# EAGLE board candy-avb (EAGLE 9.2.2), part 1 of 2
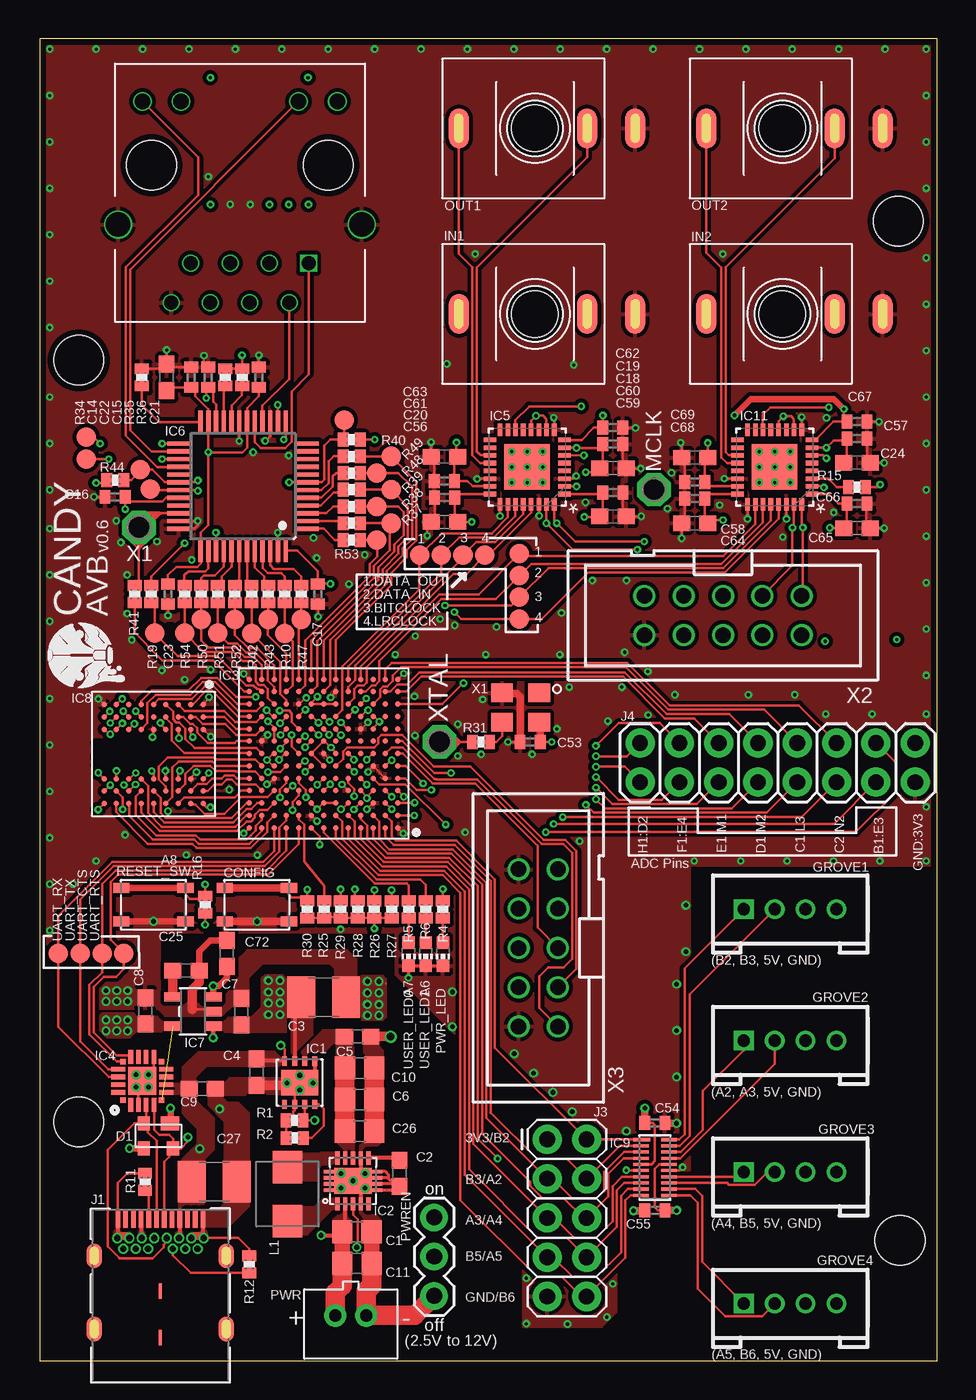
[diagram p5: board, top side]
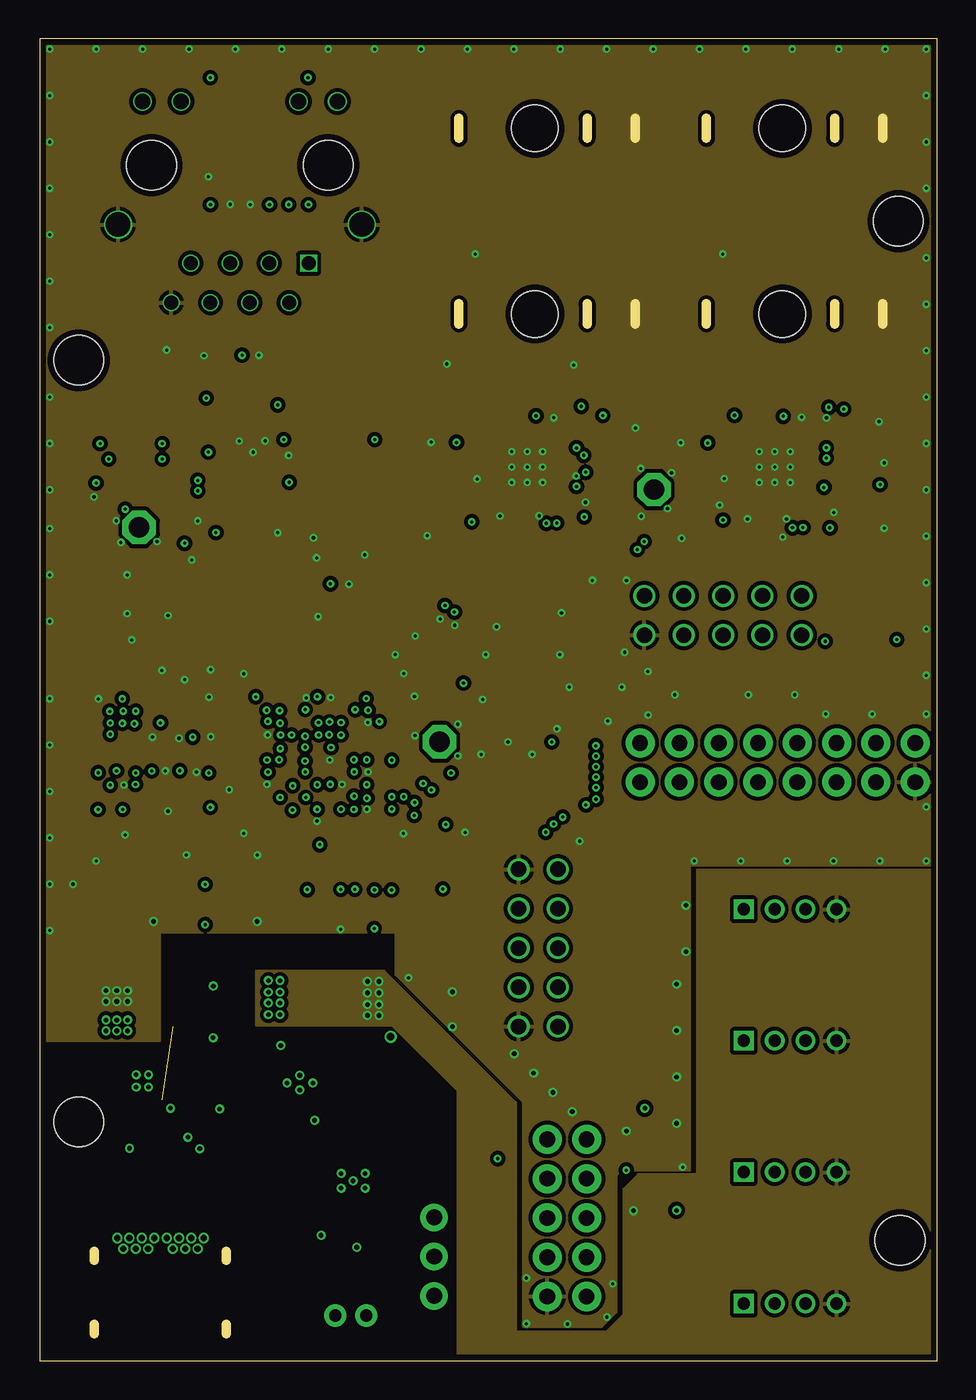
[diagram p6: board, inner layer Route2]
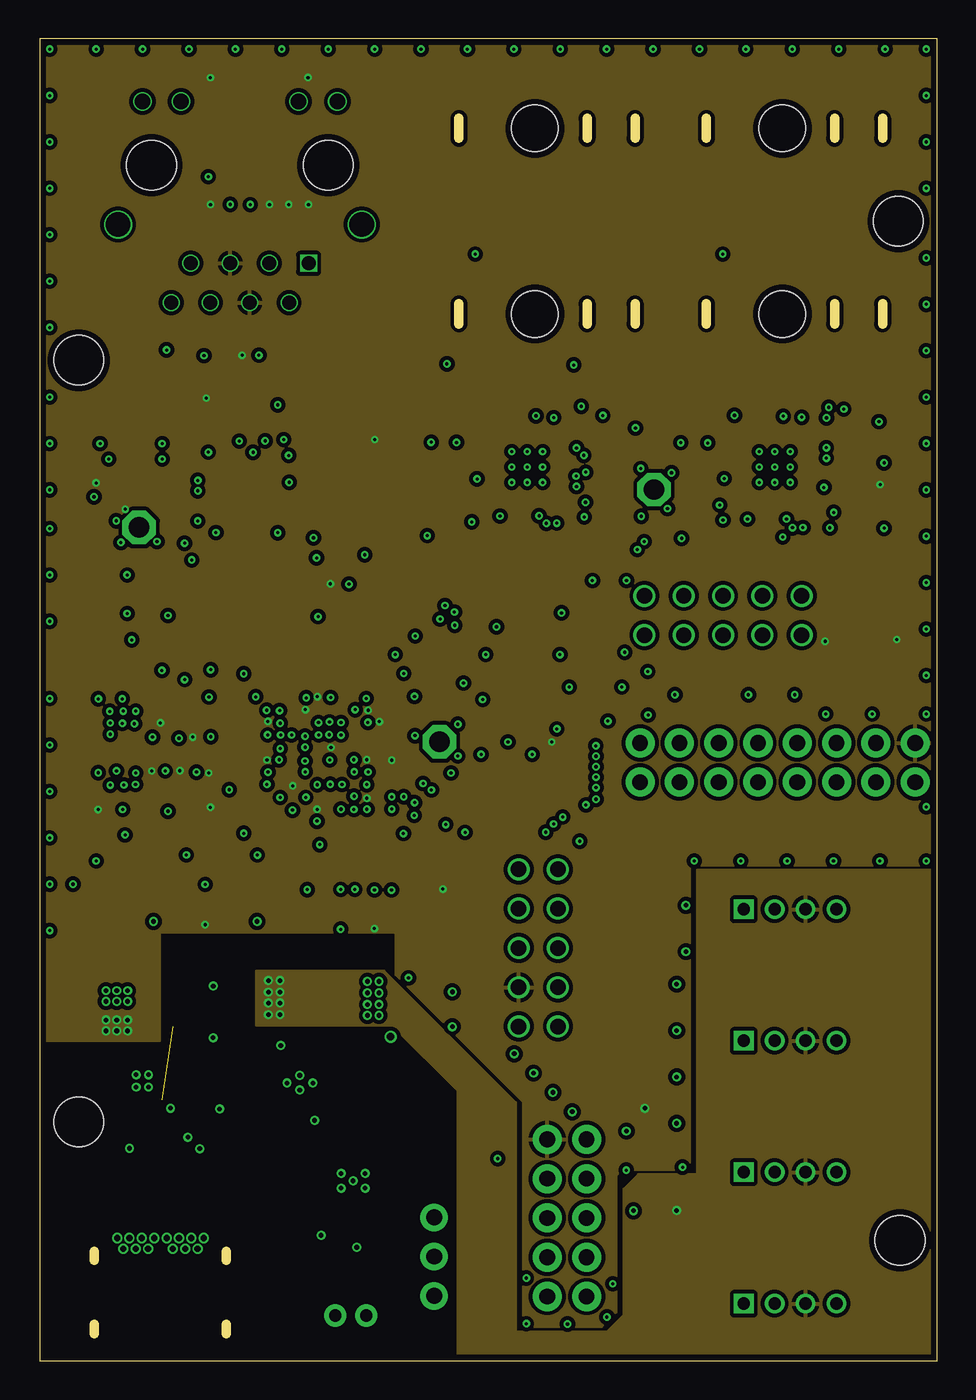
[diagram p7: board, inner layer Route3]
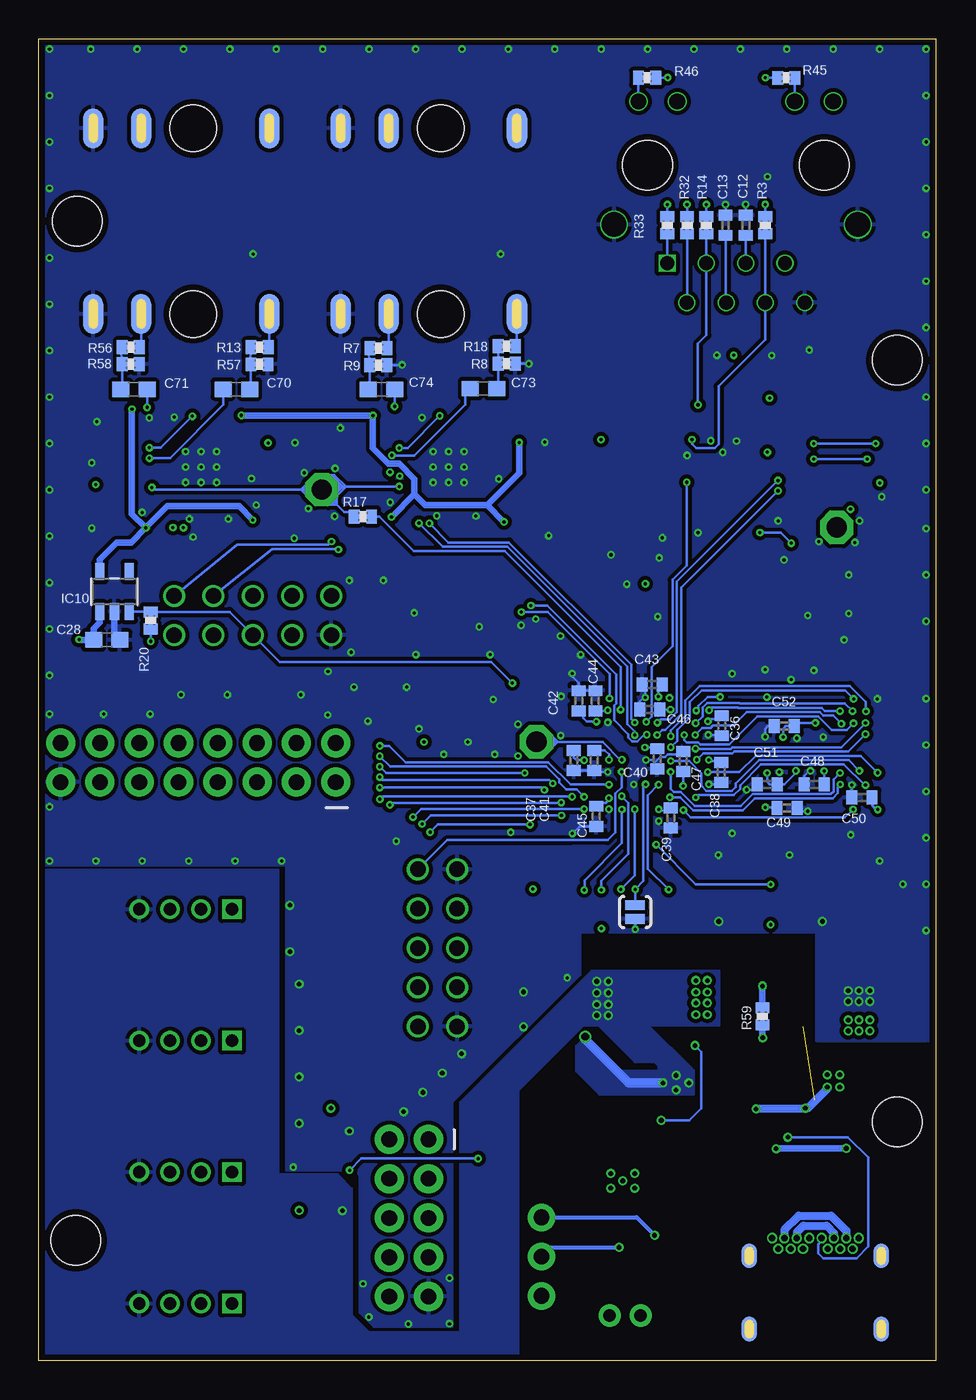
[diagram p8: board, bottom side, seen from below]

Size 58 x 85.5 mm. Coordinates in mm from the lower left corner, seen from the top.
Outline: 58,0 58,85.5 0,85.5 0,0 58,0
Copper layers (1+2*3+16): Top 0.035mm / dielectric 0.25mm / Route2 0.035mm / dielectric 1mm / Route3 0.035mm / dielectric 0.2mm / Bottom 0.035mm
Design rules "pban_5mil-l4-BGA *": minimum track width 0.1mm, minimum drill 0.2mm, track to track 0.125mm, track to pad 0.1mm, pad to pad 0.125mm, via to via 0.2mm, smd to smd 0.1mm, copper to edge 0.4mm, drill to drill 0.4mm, minimum pad ring 0.1mm, minimum via ring 0.1375mm, stop-mask expansion 4mil, vias tented up to drill 0.35mm, thermal gap 10mil
Holes 3.2 mm at 55.5,73.7 55.6,7.8 2.5,64.7 2.5,15.45
tRestrict: area 8.6,54 to 9.3,54.1; area 9,46 to 9.8,46.1; area 8.3,46.4 to 8.5,47.5; area 38.2,38.4 to 54.5,39; area 52.6,39.2 to 52.9,40.5; area 55.7,38.4 to 57.6,38.9; area 55.1,39.3 to 55.5,40.5; area 3.5,39.2 to 8.4,40; area 3.5,38.5 to 7.5,39; area 5,40.1 to 7,40.6; area 7.7,40.2 to 8.2,40.5

## Footprints (pad centres in the part's own frame; a part is rotated, then mirrored left to right if it is on the bottom)
B1,27 = smd 1.27 x 1.27: TP 0,0
C0805 = smd 1.3 x 1.5: 1 -0.95,0; 2 0.95,0
C1608 = smd 1.1 x 1: 1 -0.85,0; 2 0.85,0
C1210 = smd 1.8 x 2.7: 1 -1.45,0; 2 1.45,0
C0402 = smd 0.7 x 0.9: 1 -0.65,0; 2 0.65,0
C0603 = smd 1.1 x 1: 1 -0.85,0; 2 0.85,0
SKRPABE010 = smd 1.05 x 0.65: 1 -2.075,1.075; 2 2.075,1.075; 3 -2.075,-1.075; 4 2.075,-1.075
SOT143 = smd 0.9 x 1.2: 1 -0.8,0.75 | smd 0.9 x 0.8: 2 -0.8,-0.95; 3 0.8,-0.95; 4 0.8,0.95
SEEED_GROVE_4PIN_TH = drill 0.8 pad 1.27 square: 1 -3,0 | drill 0.8 pad 1.27: 2 -1,0; 3 1,0; 4 3,0
SON8 = smd 0.6 x 0.3: 1 -1.4,0.975; 2 -1.4,0.325; 3 -1.4,-0.325; 4 -1.4,-0.975; 5 1.4,-0.975; 6 1.4,-0.325; 7 1.4,0.325; 8 1.4,0.975 | smd 1.65 x 2.4: EP 0,0
S-PDSO-N10 = smd 0.28 x 0.85: 1 -1,-1.475; 2 -0.5,-1.475; 3 0,-1.475; 4 0.5,-1.475; 5 1,-1.475; 6 1,1.475; 7 0.5,1.475; 8 0,1.475; 9 -0.5,1.475; 10 -1,1.475 | smd 2.4 x 1.65: EP0 0,0 | smd 0.7 x 0.25: EP1 -1.55,0.6; EP2 -1.55,0.2; EP3 -1.55,-0.2; EP4 -1.55,-0.6; EP5 1.55,-0.6; EP6 1.55,-0.2; EP7 1.55,0.2; EP8 1.55,0.6
MBGA169-MAX10 = smd 0.34 x 0.34: A1 -4.8,4.8; A2 -4,4.8; A3 -3.2,4.8; A4 -2.4,4.8; A5 -1.6,4.8; A6 -0.8,4.8; A7 0,4.8; A8 0.8,4.8; A9 1.6,4.8; A10 2.4,4.8; A11 3.2,4.8; A12 4,4.8; A13 4.8,4.8; B1 -4.8,4; B2 -4,4; B3 -3.2,4; B4 -2.4,4; B5 -1.6,4; B6 -0.8,4; B7 0,4; B8 0.8,4; B9 1.6,4; B10 2.4,4; B11 3.2,4; B12 4,4; B13 4.8,4; C1 -4.8,3.2; C2 -4,3.2; C3 -3.2,3.2; C4 -2.4,3.2; C5 -1.6,3.2; C6 -0.8,3.2; C7 0,3.2; C8 0.8,3.2; C9 1.6,3.2; C10 2.4,3.2; C11 3.2,3.2; C12 4,3.2; C13 4.8,3.2; D1 -4.8,2.4; D2 -4,2.4; D3 -3.2,2.4; D4 -2.4,2.4; D5 -1.6,2.4; D6 -0.8,2.4; D7 0,2.4; D8 0.8,2.4; D9 1.6,2.4; D10 2.4,2.4; D11 3.2,2.4; D12 4,2.4; D13 4.8,2.4; E1 -4.8,1.6; E2 -4,1.6; E3 -3.2,1.6; E4 -2.4,1.6; E5 -1.6,1.6; E6 -0.8,1.6; E7 0,1.6; E8 0.8,1.6; E9 1.6,1.6; E10 2.4,1.6; E11 3.2,1.6; E12 4,1.6; E13 4.8,1.6; F1 -4.8,0.8; F2 -4,0.8; F3 -3.2,0.8; F4 -2.4,0.8; F5 -1.6,0.8; F6 -0.8,0.8; F7 0,0.8; F8 0.8,0.8; F9 1.6,0.8; F10 2.4,0.8; F11 3.2,0.8; F12 4,0.8; F13 4.8,0.8; G1 -4.8,0; G2 -4,0; G3 -3.2,0; G4 -2.4,0; G5 -1.6,0; G6 -0.8,0; G7 0,0; G8 0.8,0; G9 1.6,0; G10 2.4,0; G11 3.2,0; G12 4,0; G13 4.8,0; H1 -4.8,-0.8; H2 -4,-0.8; H3 -3.2,-0.8; H4 -2.4,-0.8; H5 -1.6,-0.8; H6 -0.8,-0.8; H7 0,-0.8; H8 0.8,-0.8; H9 1.6,-0.8; H10 2.4,-0.8; H11 3.2,-0.8; H12 4,-0.8; H13 4.8,-0.8; J1 -4.8,-1.6; J2 -4,-1.6; J3 -3.2,-1.6; J4 -2.4,-1.6; J5 -1.6,-1.6; J6 -0.8,-1.6; J7 0,-1.6; J8 0.8,-1.6; J9 1.6,-1.6; J10 2.4,-1.6; J11 3.2,-1.6; J12 4,-1.6; J13 4.8,-1.6; K1 -4.8,-2.4; K2 -4,-2.4; K3 -3.2,-2.4; K4 -2.4,-2.4; K5 -1.6,-2.4; K6 -0.8,-2.4; K7 0,-2.4; K8 0.8,-2.4; K9 1.6,-2.4; K10 2.4,-2.4; K11 3.2,-2.4; K12 4,-2.4; K13 4.8,-2.4; L1 -4.8,-3.2; L2 -4,-3.2; L3 -3.2,-3.2; L4 -2.4,-3.2; L5 -1.6,-3.2; L6 -0.8,-3.2; L7 0,-3.2; L8 0.8,-3.2; L9 1.6,-3.2; L10 2.4,-3.2; L11 3.2,-3.2; L12 4,-3.2; L13 4.8,-3.2; M1 -4.8,-4; M2 -4,-4; M3 -3.2,-4; M4 -2.4,-4; M5 -1.6,-4; M6 -0.8,-4; M7 0,-4; M8 0.8,-4; M9 1.6,-4; M10 2.4,-4; M11 3.2,-4; M12 4,-4; M13 4.8,-4; N1 -4.8,-4.8; N2 -4,-4.8; N3 -3.2,-4.8; N4 -2.4,-4.8; N5 -1.6,-4.8; N6 -0.8,-4.8; N7 0,-4.8; N8 0.8,-4.8; N9 1.6,-4.8; N10 2.4,-4.8; N11 3.2,-4.8; N12 4,-4.8; N13 4.8,-4.8
CP2102-QFN20 = smd 0.35 x 0.35: 1 -1.25,1.25; 6 -1.25,-1.25; 11 1.25,-1.25; 16 1.25,1.25 | smd 0.9 x 0.3: 2 -1.55,0.75; 3 -1.55,0.25; 4 -1.55,-0.25; 5 -1.55,-0.75; 12 1.55,-0.75; 13 1.55,-0.25; 14 1.55,0.25; 15 1.55,0.75 | smd 0.3 x 0.9: 7 -0.75,-1.55; 8 -0.25,-1.55; 9 0.25,-1.55; 10 0.75,-1.55; 17 0.75,1.55; 18 0.25,1.55; 19 -0.25,1.55; 20 -0.75,1.55 | smd 1.8 x 1.8: GND 0,0
QFN50_500X500_33_O = smd 0.813 x 0.305: 1 -2.413,1.753; 2 -2.413,1.245; 3 -2.413,0.762; 4 -2.413,0.254; 5 -2.413,-0.254; 6 -2.413,-0.762; 7 -2.413,-1.245; 8 -2.413,-1.753; 17 2.413,-1.753; 18 2.413,-1.245; 19 2.413,-0.762; 20 2.413,-0.254; 21 2.413,0.254; 22 2.413,0.762; 23 2.413,1.245; 24 2.413,1.753 | smd 0.305 x 0.813: 9 -1.753,-2.413; 10 -1.245,-2.413; 11 -0.762,-2.413; 12 -0.254,-2.413; 13 0.254,-2.413; 14 0.762,-2.413; 15 1.245,-2.413; 16 1.753,-2.413; 25 1.753,2.413; 26 1.245,2.413; 27 0.762,2.413; 28 0.254,2.413; 29 -0.254,2.413; 30 -0.762,2.413; 31 -1.245,2.413; 32 -1.753,2.413 | smd 2.946 x 2.946: 33 0,0
LQFP48 = smd 1.5 x 0.279: 1 -4.15,2.75; 2 -4.15,2.25; 3 -4.15,1.75; 4 -4.15,1.25; 5 -4.15,0.75; 6 -4.15,0.25; 7 -4.15,-0.25; 8 -4.15,-0.75; 9 -4.15,-1.25; 10 -4.15,-1.75; 11 -4.15,-2.25; 12 -4.15,-2.75; 25 4.15,-2.75; 26 4.15,-2.25; 27 4.15,-1.75; 28 4.15,-1.25; 29 4.15,-0.75; 30 4.15,-0.25; 31 4.15,0.25; 32 4.15,0.75; 33 4.15,1.25; 34 4.15,1.75; 35 4.15,2.25; 36 4.15,2.75 | smd 0.279 x 1.5: 13 -2.75,-4.15; 14 -2.25,-4.15; 15 -1.75,-4.15; 16 -1.25,-4.15; 17 -0.75,-4.15; 18 -0.25,-4.15; 19 0.25,-4.15; 20 0.75,-4.15; 21 1.25,-4.15; 22 1.75,-4.15; 23 2.25,-4.15; 24 2.75,-4.15; 37 2.75,4.15; 38 2.25,4.15; 39 1.75,4.15; 40 1.25,4.15; 41 0.75,4.15; 42 0.25,4.15; 43 -0.25,4.15; 44 -0.75,4.15; 45 -1.25,4.15; 46 -1.75,4.15; 47 -2.25,4.15; 48 -2.75,4.15
SOT23-5 = smd 1.1 x 0.6: 1 -1.3,0.95; 2 -1.3,0; 3 -1.3,-0.95; 4 1.3,-0.95; 5 1.3,0.95
FBGA54-AS4C4M16SA = smd 0.34 x 0.34: A1 -3.2,3.2; A2 -2.4,3.2; A3 -1.6,3.2; A7 1.6,3.2; A8 2.4,3.2; A9 3.2,3.2; B1 -3.2,2.4; B2 -2.4,2.4; B3 -1.6,2.4; B7 1.6,2.4; B8 2.4,2.4; B9 3.2,2.4; C1 -3.2,1.6; C2 -2.4,1.6; C3 -1.6,1.6; C7 1.6,1.6; C8 2.4,1.6; C9 3.2,1.6; D1 -3.2,0.8; D2 -2.4,0.8; D3 -1.6,0.8; D7 1.6,0.8; D8 2.4,0.8; D9 3.2,0.8; E1 -3.2,0; E2 -2.4,0; E3 -1.6,0; E7 1.6,0; E8 2.4,0; E9 3.2,0; F1 -3.2,-0.8; F2 -2.4,-0.8; F3 -1.6,-0.8; F7 1.6,-0.8; F8 2.4,-0.8; F9 3.2,-0.8; G1 -3.2,-1.6; G2 -2.4,-1.6; G3 -1.6,-1.6; G7 1.6,-1.6; G8 2.4,-1.6; G9 3.2,-1.6; H1 -3.2,-2.4; H2 -2.4,-2.4; H3 -1.6,-2.4; H7 1.6,-2.4; H8 2.4,-2.4; H9 3.2,-2.4; J1 -3.2,-3.2; J2 -2.4,-3.2; J3 -1.6,-3.2; J7 1.6,-3.2; J8 2.4,-3.2; J9 3.2,-3.2
USON20 = smd 1.1 x 0.2: 1 -0.85,1.8 | smd 1 x 0.2: 2 -0.9,1.4; 3 -0.9,1; 4 -0.9,0.6; 5 -0.9,0.2; 6 -0.9,-0.2; 7 -0.9,-0.6; 8 -0.9,-1; 9 -0.9,-1.4; 10 -0.9,-1.8; 11 0.9,-1.8; 12 0.9,-1.4; 13 0.9,-1; 14 0.9,-0.6; 15 0.9,-0.2; 16 0.9,0.2; 17 0.9,0.6; 18 0.9,1; 19 0.9,1.4; 20 0.9,1.8
THONKICONN-JACK-4 = smd 2.6 x 1.3 bottom: 1B 0,-6.48; 2B 0,-3.38; 3B 0,4.92 | smd 2.6 x 1.3: 1T 0,-6.48; 2T 0,-3.38; 3T 0,4.92 | hole 3: 0,0
USB_TYPEC_WE_632723 = smd 0.3 x 1.2: A1 -2.75,10.58; A2 -2.25,10.58; A3 -1.75,10.58; A4 -1.25,10.58; A5 -0.75,10.58; A6 -0.25,10.58; A7 0.25,10.58; A8 0.75,10.58; A9 1.25,10.58; A10 1.75,10.58; A11 2.25,10.58; A12 2.75,10.58 | drill 0.4 pad 0.65: B1 2.8,9.33; B2 2.4,8.63; B3 1.6,8.63; B4 1.2,9.33; B5 0.8,8.63; B6 0.4,9.33; B7 -0.4,9.33; B8 -0.8,8.63; B9 -1.2,9.33; B10 -1.6,8.63; B11 -2.4,8.63; B12 -2.8,9.33; CPP0 2,9.33; CPP1 -2,9.33 | smd 0.2 x 1: P$1 0,2.9; P$2 0,5.9 | smd 1 x 1.6: P$3 -4.27,8.18; P$4 -4.27,3.45; P$5 4.27,3.45; P$6 4.27,8.18 | smd 1 x 1.6 bottom: P$7 -4.27,8.18; P$8 -4.27,3.45; P$9 4.27,3.45; P$10 4.27,8.18
TE_MODULAR_JACK_1734577-1 = drill 0.9 square: 1 4.445,-6.35 | drill 0.9: 2 3.175,-8.89; 3 1.905,-6.35; 4 0.635,-8.89; 5 -0.635,-6.35; 6 -1.905,-8.89; 7 -3.175,-6.35; 8 -4.445,-8.89 | drill 1.016: 9 -6.3,4.11; 10 -3.81,4.11; 11 3.785,4.11; 12 6.3,4.11 | drill 1.6: S1 -7.875,-3.85; S2 7.875,-3.85 | hole 3.2: -5.715,0; 5.715,0
2X5 = drill 1.016 pad 1.88: 1 0,0; 2 0,2.54; 3 2.54,0; 4 2.54,2.54; 5 5.08,0; 6 5.08,2.54; 7 7.62,0; 8 7.62,2.54; 9 10.16,0; 10 10.16,2.54
2X8 = drill 1.016 pad 1.88: 1 0,0; 2 0,2.54; 3 2.54,0; 4 2.54,2.54; 5 5.08,0; 6 5.08,2.54; 7 7.62,0; 8 7.62,2.54; 9 10.16,0; 10 10.16,2.54; 11 12.7,0; 12 12.7,2.54; 13 15.24,0; 14 15.24,2.54; 15 17.78,0; 16 17.78,2.54
SJ_2S-NO = smd 0.635 x 1.27: 1 -0.45,0; 2 0.45,0
L4240 = smd 2.1 x 1.9: 1 -1.75,0; 2 1.75,0
P1-13 = drill 1.321 pad 2.159 octagon: TP 0,0
JST-PH-2-THM = drill 0.8 pad 1.422: 1 1,0; 2 -1,0
CHIPLED_0603 = smd 0.8 x 0.8: A 0,-0.75; C 0,0.75
1X03 = drill 1.016 pad 1.778: 1 0,0; 2 2.54,0; 3 5.08,0
0402-RES = smd 0.7 x 0.9: 1 -0.55,0; 2 0.55,0
SMD3225_4_EPSON = smd 1.4 x 1.2: 1 -1.2,-0.95; 2 1.2,-0.95; 3 1.2,0.95; 4 -1.2,0.95
PAK100/2500-10 = drill 1 pad 1.422: 1 -5.08,-1.27; 2 -5.08,1.27; 3 -2.54,-1.27; 4 -2.54,1.27; 5 0,-1.27; 6 0,1.27; 7 2.54,-1.27; 8 2.54,1.27; 9 5.08,-1.27; 10 5.08,1.27

## Placement (x,y rotation side)
1.DATA_OUT  TPB1,27  [B1,27]  24.54,52.1 0 top
2.DATA_IN  TPB1,27  [B1,27]  25.95,52.1 0 top
3.BITCLOCK  TPB1,27  [B1,27]  27.35,52.1 0 top
4.LRCLOCK  TPB1,27  [B1,27]  28.75,52.1 0 top
BITCLOCK1  TPB1,27  [B1,27]  31,49.38 0 top
C1  10uF  [C0805]  20.49,8.34 0 top
C2  0.1uF  [C1608]  23.24,12.12 270 top
C3  47uF  [C1210]  18.34,23.52 0 top
C4  0.1uF  [C1608]  13.99,18.67 270 top
C5  0.1uF  [C1608]  20.54,20.97 0 top
C6  22uF  [C0805]  20.67,16.9 0 top
C7  1uF  [C1608]  13.03,22.58 90 top
C8  2.2uF tant  [C1608]  6.83,22.63 90 top
C9  0.1uF  [C1608]  10.49,17.59 0 top
C10  22uF  [C0805]  20.67,18.94 0 top
C11  10uF  [C0805]  20.49,6.31 0 top
C12  0.1uF  [C0402]  12.3,73.43 90 bottom
C13  0.1uF  [C0402]  13.6,73.43 90 bottom
C14  10uF tant  [C0603]  8.19,63.6 90 top
C15  0.1uF  [C0402]  10.87,63.6 90 top
C16  0.1uF  [C0402]  4.86,55.87 180 top
C17  0.1uF  [C0402]  17.96,49.58 270 top
C18  10uF  [C0603]  37.04,57.72 0 top
C19  0.1uF  [C0402]  37.03,59.28 0 top
C20  0.1uF  [C0402]  26.16,55.82 180 top
C21  0.1uF  [C0402]  14.16,63.6 90 top
C22  0.1uF  [C0402]  9.78,63.6 90 top
C23  0.1uF  [C0402]  8.28,49.58 270 top
C24  10uF  [C0603]  52.82,58.08 0 top
C25  470pF  [C1608]  9.45,25.24 0 top
C26  22uF  [C0805]  20.67,14.86 0 top
C27  47uF  [C1210]  11.27,11.59 0 top
C28  1uF  [C0603]  53.6,46.62 0 bottom
C36  0.1uF  [C0402]  13.85,41.07 270 bottom
C37  0.1uF  [C0402]  23.4,38.83 270 bottom
C38  0.1uF  [C0402]  13.88,38.05 270 bottom
C39  0.1uF  [C0402]  17.13,35.1 270 bottom
C40  0.1uF  [C0402]  18.02,38.93 270 bottom
C41  0.1uF  [C0402]  22.08,38.83 270 bottom
C42  0.1uF  [C0402]  23.09,42.68 90 bottom
C43  0.1uF  [C0402]  18.34,43.74 180 bottom
C44  0.1uF  [C0402]  22.01,42.68 90 bottom
C45  0.1uF  [C0402]  21.95,35.22 270 bottom
C46  0.1uF  [C0402]  18.5,42.11 180 bottom
C47  0.1uF  [C0402]  16.34,38.76 90 bottom
C48  0.1uF  [C0402]  7.87,37.28 180 bottom
C49  0.1uF  [C0402]  9.62,35.75 0 bottom
C50  0.1uF  [C0402]  4.78,36.44 180 bottom
C51  0.1uF  [C0402]  10.9,37.28 180 bottom
C52  0.1uF  [C0402]  9.8,41.05 180 bottom
C53  0.01uF  [C0402]  31.69,40.02 180 top
C54  0.1uF  [C0402]  39.76,15.4 0 top
C55  0.1uF  [C0402]  39.76,9.73 180 top
C56  10uF  [C0603]  26.16,54.25 180 top
C57  0.1uF  [C0402]  52.82,59.65 0 top
C58  0.1uF  [C0402]  42.33,55.75 180 top
C59  10uF  [C0603]  37.04,54.6 0 top
C60  0.1uF  [C0402]  37.04,56.16 0 top
C61  0.1uF  [C0402]  26.15,56.89 0 top
C62  0.1uF  [C0402]  37.03,60.34 180 top
C63  10uF  [C0603]  26.15,58.46 0 top
C64  10uF  [C0603]  42.33,54.17 180 top
C65  10uF  [C0603]  52.82,53.85 0 top
C66  0.1uF  [C0402]  52.82,55.43 0 top
C67  0.1uF  [C0402]  52.82,60.73 180 top
C68  0.1uF  [C0402]  42.33,56.83 0 top
C69  10uF  [C0603]  42.33,58.41 0 top
C70  10uF  [C1608]  45.22,62.83 180 bottom
C71  10uF  [C1608]  51.84,62.82 0 bottom
C72  0.1uF  [C1608]  12.08,26.35 90 top
C73  10uF  [C1608]  29.25,62.87 180 bottom
C74  10uF  [C1608]  35.83,62.82 0 bottom
CONFIG  [SKRPABE010]  14.02,29.5 0 top
D1  SP0503BAHT  [SOT143]  7.67,14.54 270 top
DATA_IN1  TPB1,27  [B1,27]  31,50.78 0 top
DATA_OUT1  TPB1,27  [B1,27]  31,52.19 0 top
GROVE1  4P-2.0  [SEEED_GROVE_4PIN_TH]  48.5,29.2 0 top
GROVE2  4P-2.0  [SEEED_GROVE_4PIN_TH]  48.5,20.7 0 top
GROVE3  4P-2.0  [SEEED_GROVE_4PIN_TH]  48.5,12.2 0 top
GROVE4  4P-2.0  [SEEED_GROVE_4PIN_TH]  48.5,3.7 0 top
IC1  TPS2115ASON  [SON8]  16.8,17.99 90 top
IC2  TPS63061  [S-PDSO-N10]  20.24,11.64 0 top
IC3  10M08SCUBGA169  [MBGA169-MAX10]  18.34,39.27 180 top
IC4  CP2012N-20  [CP2102-QFN20]  6.62,18.11 90 top
IC5  ADAU1761ORIGINAL  [QFN50_500X500_33_O]  31.5,57.8 180 top
IC6  DP83848  [LQFP48]  13.14,56.56 180 top
IC7  MIC5219-3.3YM5  [SOT23-5]  9.89,22.59 180 top
IC8  [FBGA54-AS4C4M16SA]  7.35,39.24 270 top
IC9  TXB0108ZXYR  [USON20]  39.76,12.51 0 top
IC10  MIC2005A  [SOT23-5]  53.1,49.74 90 bottom
IC11  ADAU1761ORIGINAL  [QFN50_500X500_33_O]  47.5,57.8 180 top
IN1  THONKICONN-STEREO-JACK4L  [THONKICONN-JACK-4]  32,67.7 90 top
IN2  THONKICONN-STEREO-JACK4L  [THONKICONN-JACK-4]  48,67.7 90 top
J1  [USB_TYPEC_WE_632723]  7.79,-1.39 0 top
J2  TE_MODULAR_JACK_1734577-1TOP  [TE_MODULAR_JACK_1734577-1]  12.93,77.33 0 top
J3  [2X5]  32.8,14.32 270 top
J4  2X6 FEMALE  [2X8]  38.8,37.42 0 top
JP1  [SJ_2S-NO]  19.45,29.02 270 bottom
L1  1uH  [L4240]  16,10.79 270 top
LRCLOCK1  TPB1,27  [B1,27]  31,47.98 0 top
MCLK  TPPAD1-13  [P1-13]  39.7,56.34 0 top
OUT1  THONKICONN-STEREO-JACK4L  [THONKICONN-JACK-4]  32,79.7 90 top
OUT2  THONKICONN-STEREO-JACK4L  [THONKICONN-JACK-4]  48,79.7 90 top
PWR  [JST-PH-2-THM]  20.09,2.93 180 top
PWR_LED  LEDSMD_0603  [CHIPLED_0603]  26.05,26.3 180 top
PWREN  [1X03]  25.49,4.2 90 top
R1  10k  [0402-RES]  16.46,15.55 0 top
R2  255  [0402-RES]  16.48,14.4 0 top
R3  49.9  [0402-RES]  11.03,73.43 90 bottom
R4  1k  [0402-RES]  26.05,29.2 90 top
R5  1k  [0402-RES]  23.83,29.2 90 top
R6  1k  [0402-RES]  24.95,29.2 90 top
R7  1k  [0402-RES]  36.03,65.5 180 bottom
R8  49.9k  [0402-RES]  27.75,64.49 0 bottom
R9  49.9k  [0402-RES]  36.04,64.4 0 bottom
R10  33  [0402-RES]  15.82,49.58 90 top
R11  5.1k  [0402-RES]  6.79,11.58 270 top
R12  5.1k  [0402-RES]  13.52,6.24 270 top
R13  1k  [0402-RES]  43.72,65.55 180 bottom
R14  49.9  [0402-RES]  14.84,73.43 90 bottom
R15  10k  [0402-RES]  52.82,56.5 180 top
R16  10k  [0402-RES]  10.68,29.5 270 top
R17  33  [0402-RES]  37.04,54.6 180 bottom
R18  1k  [0402-RES]  27.75,65.61 180 bottom
R19  33  [0402-RES]  7.2,49.58 90 top
R20  10k  [0402-RES]  50.76,47.88 90 bottom
R25  10k  [0402-RES]  18.38,29.2 270 top
R26  10k  [0402-RES]  21.62,29.2 270 top
R27  10k  [0402-RES]  22.73,29.2 270 top
R28  10k  [0402-RES]  20.54,29.2 270 top
R29  10k  [0402-RES]  19.45,29.2 270 top
R30  10k  [0402-RES]  17.29,29.2 270 top
R31  33  [0402-RES]  28.51,40.03 0 top
R32  49.9  [0402-RES]  16.09,73.43 90 bottom
R33  49.9  [0402-RES]  17.36,73.43 90 bottom
R34  4.87k  [0402-RES]  6.59,63.6 90 top
R35  2.2k  [0402-RES]  11.97,63.6 90 top
R36  2.2k  [0402-RES]  13.07,63.6 90 top
R37  33  [0402-RES]  20.15,54.16 180 top
R38  33  [0402-RES]  20.15,55.25 180 top
R39  33  [0402-RES]  20.15,56.34 180 top
R40  1.5k  [0402-RES]  20.15,59.57 0 top
R41  33  [0402-RES]  6.12,49.58 90 top
R42  33  [0402-RES]  13.68,49.58 90 top
R43  33  [0402-RES]  14.75,49.58 90 top
R44  1.5k  [0402-RES]  4.87,56.95 0 top
R45  330  [0402-RES]  9.68,82.96 0 bottom
R46  330  [0402-RES]  18.67,82.97 180 bottom
R47  33  [0402-RES]  16.89,49.58 90 top
R48  33  [0402-RES]  20.15,57.41 180 top
R49  33  [0402-RES]  20.15,58.49 180 top
R50  33  [0402-RES]  10.43,49.58 90 top
R51  33  [0402-RES]  11.51,49.58 90 top
R52  33  [0402-RES]  12.61,49.58 90 top
R53  33  [0402-RES]  20.15,53.08 180 top
R54  33  [0402-RES]  9.35,49.58 90 top
R56  1k  [0402-RES]  52.04,65.55 180 bottom
R57  49.9k  [0402-RES]  43.73,64.44 0 bottom
R58  49.9k  [0402-RES]  52.05,64.45 0 bottom
R59  10k  [0402-RES]  11.21,22.28 90 bottom
RESET_SW  [SKRPABE010]  7.34,29.5 0 top
TP1  TPPAD1-13  [P1-13]  6.41,53.89 0 top
TP2  TPB1,27  [B1,27]  9.35,47.05 0 top
TP3  TPB1,27  [B1,27]  10.43,47.94 0 top
TP4  TPB1,27  [B1,27]  11.51,47.05 0 top
TP5  TPB1,27  [B1,27]  12.61,47.94 0 top
TP6  TPB1,27  [B1,27]  13.68,47.04 0 top
TP7  TPB1,27  [B1,27]  14.75,47.94 0 top
TP8  TPB1,27  [B1,27]  15.82,47.04 0 top
TP9  TPB1,27  [B1,27]  16.89,47.94 0 top
TP10  TPB1,27  [B1,27]  21.79,53.08 0 top
TP11  TPB1,27  [B1,27]  22.7,54.16 0 top
TP12  TPB1,27  [B1,27]  21.79,55.25 0 top
TP13  TPB1,27  [B1,27]  22.7,56.34 0 top
TP14  TPB1,27  [B1,27]  21.79,57.41 0 top
TP15  TPB1,27  [B1,27]  22.7,58.49 0 top
TP16  TPB1,27  [B1,27]  19.68,60.84 0 top
TP17  TPB1,27  [B1,27]  6.49,57.62 0 top
TP18  TPB1,27  [B1,27]  7.13,56.38 0 top
TP19  TPB1,27  [B1,27]  7.41,47.05 0 top
TP20  TPB1,27  [B1,27]  3,58.31 0 top
TP21  TPB1,27  [B1,27]  3,59.72 0 top
U$2  [CANDY-ICON]  5.47,43.52 90 top
UART_CTS  TPB1,27  [B1,27]  4.03,26.36 0 top
UART_RTS  TPB1,27  [B1,27]  5.43,26.36 0 top
UART_RX  TPB1,27  [B1,27]  1.19,26.36 0 top
UART_TX  TPB1,27  [B1,27]  2.62,26.36 0 top
USER_LED0  LEDSMD_0603  [CHIPLED_0603]  23.83,26.3 180 top
USER_LED1  LEDSMD_0603  [CHIPLED_0603]  24.94,26.3 180 top
X1  48MHz  [SMD3225_4_EPSON]  31.08,42.24 180 top
X2  USBi  [PAK100/2500-10]  44.16,48.2 180 top
X3  USB Blaster  [PAK100/2500-10]  32.22,26.7 90 top
XTAL  TPPAD1-13  [P1-13]  25.83,40.03 0 top